# EAGLE design top (EAGLE 9.6.2)
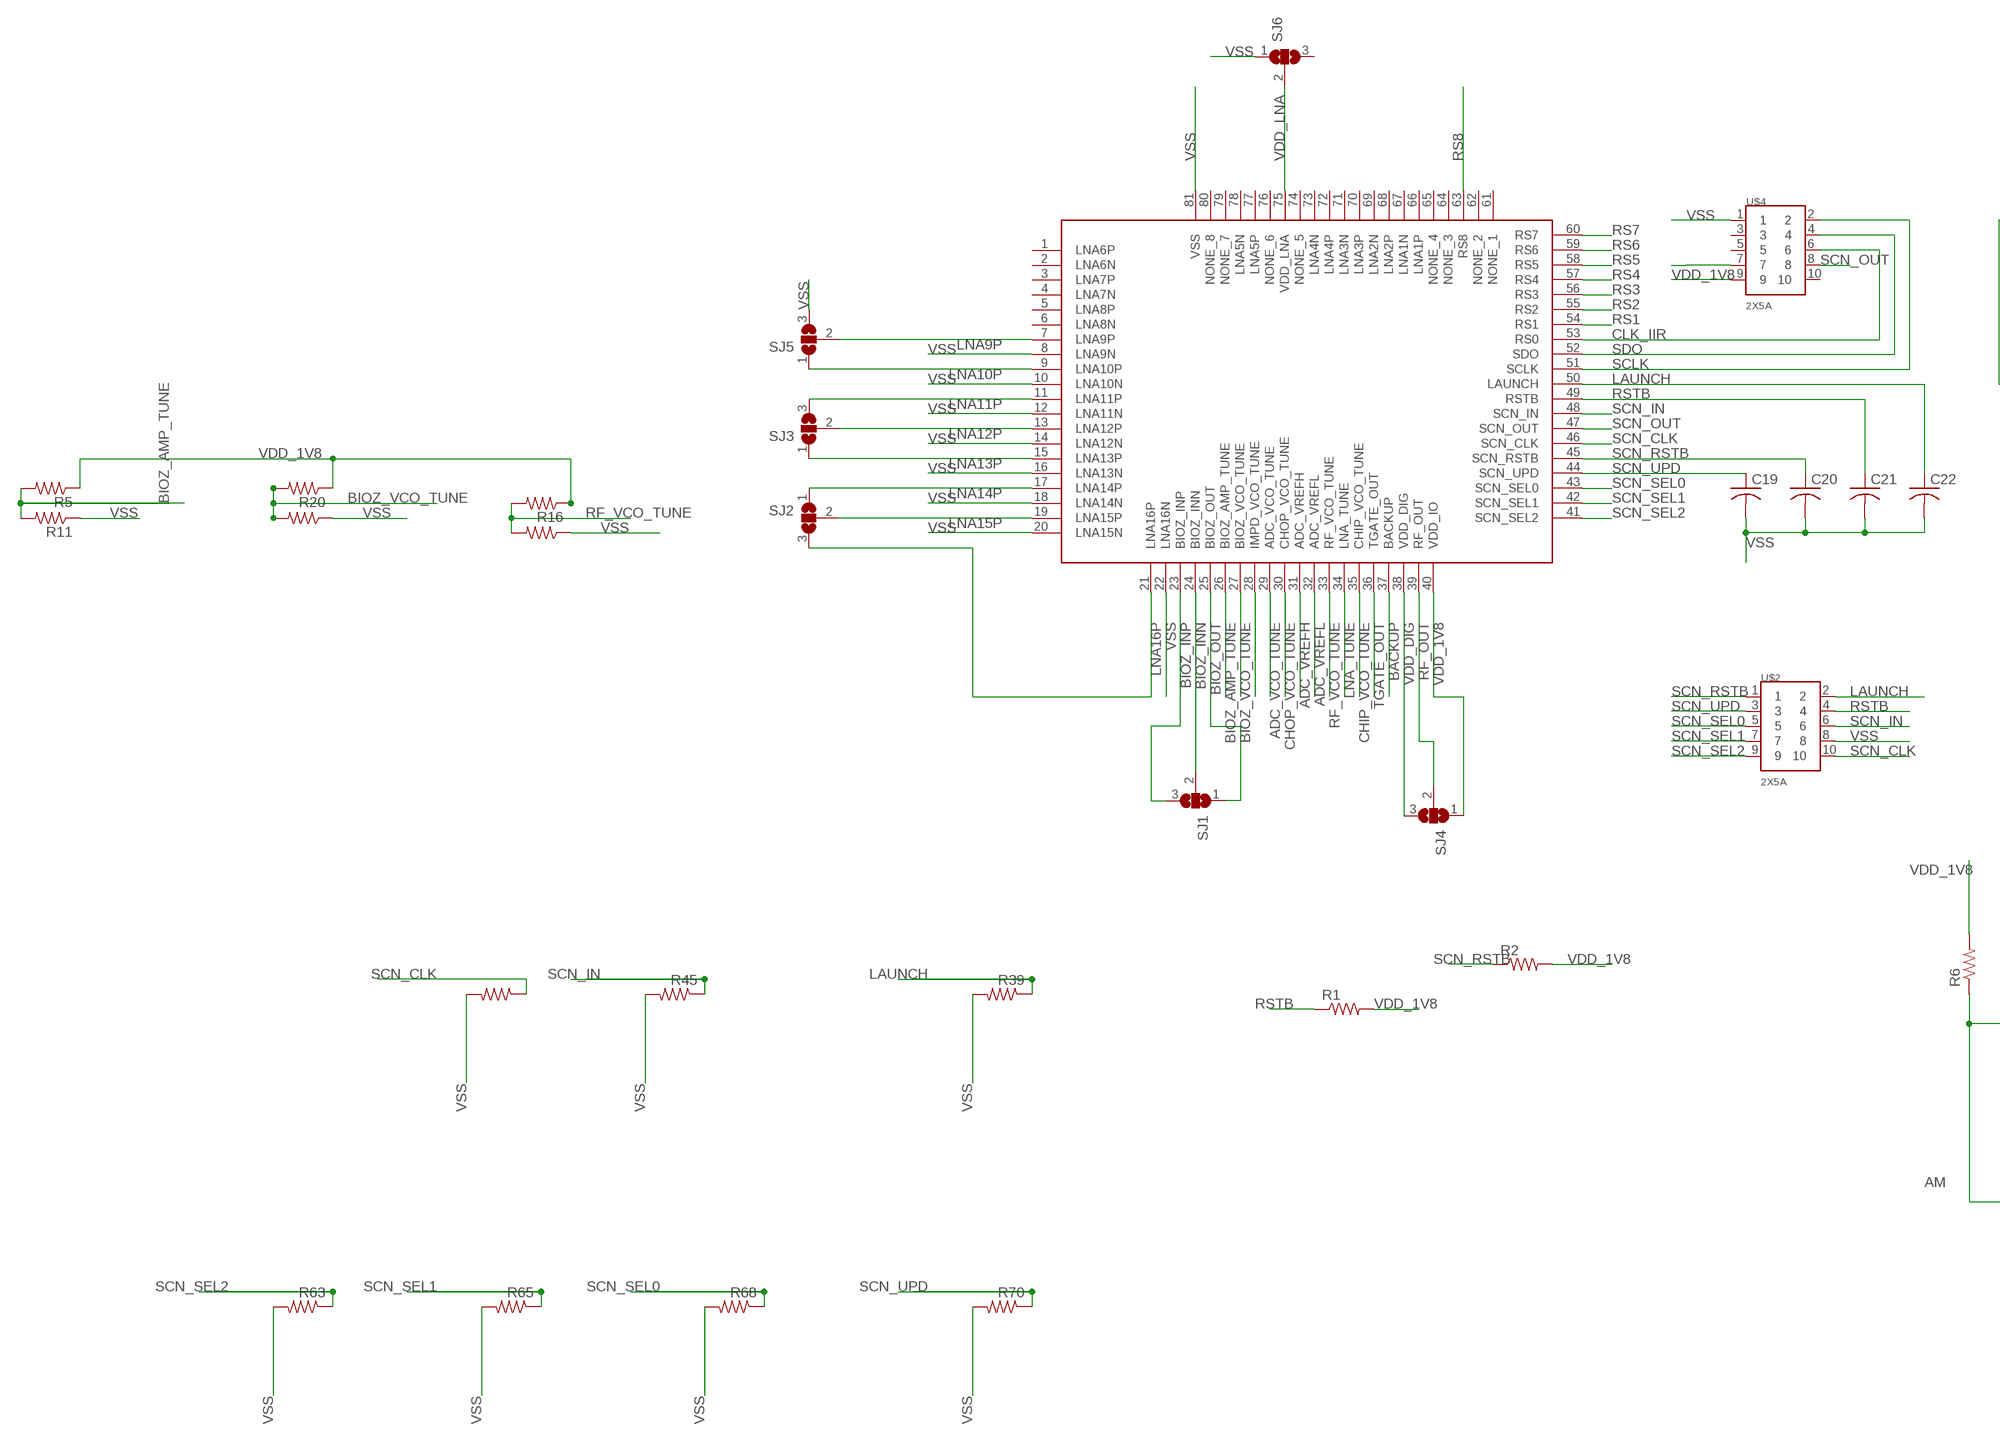
[diagram p0: schematic, sheet 1, part 1 of 2]
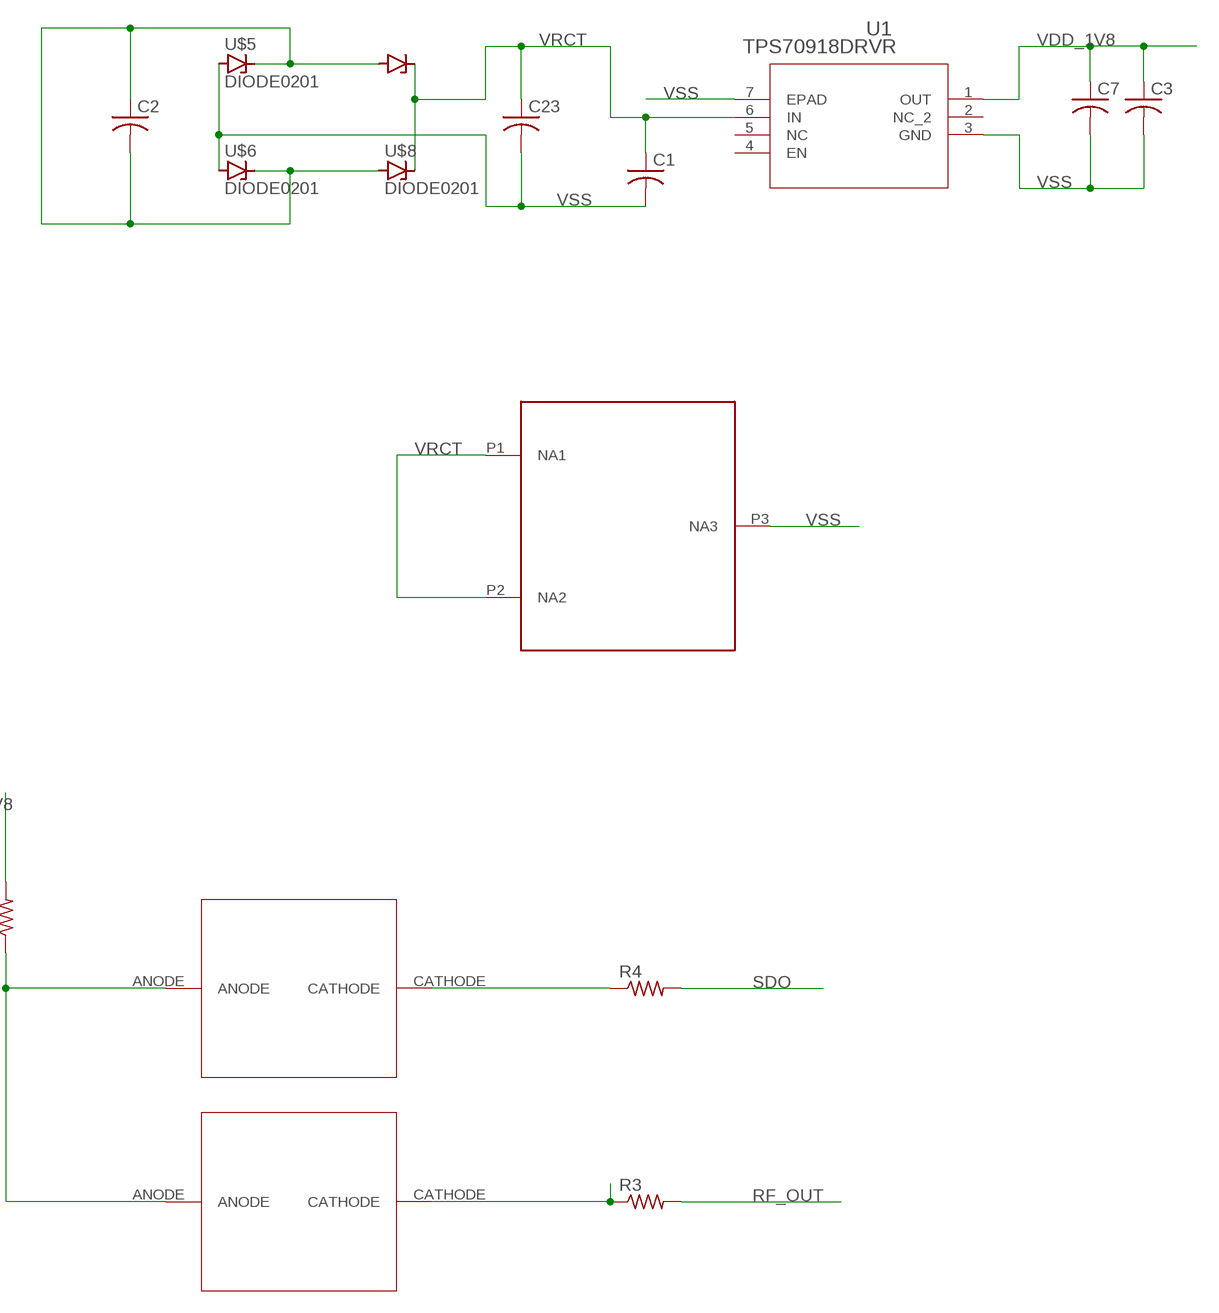
[diagram p1: schematic, sheet 1, part 2 of 2]

## Parts
C1  C-USC0402  [C0402]
C2  C-USC0201  [C0201]
C3  C-USC0402  [C0402]
C7  C-USC1210  [C1210]
C19  C-USC0201  [C0201]
C20  C-USC0201  [C0201]
C21  C-USC0201  [C0201]
C22  C-USC0201  [C0201]
C23  C-USC1210  [C1210]
R1  R-US_R0402  [R0402]
R2  R-US_R0402  [R0402]
R3  R-US_R0402  [R0402]
R4  R-US_R0402  [R0402]
R5  R-US_R0201  [R0201]
R6  R-US_R0402  [R0402]
R11  R-US_R0201  [R0201]
R16  R-US_R0201  [R0201]
R17  R-US_R0201  [R0201]
R20  R-US_R0201  [R0201]
R22  R-US_R0201  [R0201]
R39  R-US_R0402  [R0402]
R45  R-US_R0402  [R0402]
R47  R-US_R0402  [R0402]
R63  R-US_R0402  [R0402]
R65  R-US_R0402  [R0402]
R68  R-US_R0402  [R0402]
R70  R-US_R0402  [R0402]
SJ1  SJ2W  [SJ_2]
SJ2  SJ2W  [SJ_2]
SJ3  SJ2W  [SJ_2]
SJ4  SJ2W  [SJ_2]
SJ5  SJ2W  [SJ_2]
SJ6  SJ2W  [SJ_2]
U1  TPS70918DRVR  [DRV6_1P6X1_TEX]
U$1  CHIP_QFN  [QFN50P1200X1200X80-81T900N]
U$2  2X5A  [2X5-FCI_UNSHROUDED]
U$3  3030TR  [3030TR]
U$4  2X5A  [2X5-FCI_UNSHROUDED]
U$5  DIODE0201  [C0201]
U$6  DIODE0201  [C0201]
U$7  DIODE0201  [C0201]
U$8  DIODE0201  [C0201]
U$9  MSWSE-050-17  [DIODE_MSWSE-050-17]
U$10  MSWSE-050-17  [DIODE_MSWSE-050-17]

## Nets
ADC_VCO_TUNE: U$1.29(ADC_VCO_TUNE)
ADC_VREFH: U$1.31(ADC_VREFH)
ADC_VREFL: U$1.32(ADC_VREFL)
AM: R6.1 U$4.7 U$9.ANODE U$10.ANODE
BACKUP: U$1.37(BACKUP)
BIOZ_AMP_TUNE: R5.2 R11.2 U$1.26(BIOZ_AMP_TUNE)
BIOZ_INN: SJ1.2 U$1.24(BIOZ_INN)
BIOZ_INP: SJ1.3 U$1.23(BIOZ_INP)
BIOZ_OUT: SJ1.1 U$1.25(BIOZ_OUT)
BIOZ_VCO_TUNE: R20.2 R22.2 U$1.27(BIOZ_VCO_TUNE)
CHIP_VCO_TUNE: U$1.35(CHIP_VCO_TUNE)
CHOP_VCO_TUNE: U$1.30(CHOP_VCO_TUNE)
CLK_IIR: U$1.53(RS0) U$4.6
LAUNCH: C22.1 R39.1 U$1.50(LAUNCH) U$2.2
LNA9P: SJ5.2 U$1.7(LNA9P)
LNA10P: SJ5.1 U$1.9(LNA10P)
LNA11P: SJ3.3 U$1.11(LNA11P)
LNA12P: SJ3.2 U$1.13(LNA12P)
LNA13P: SJ3.1 U$1.15(LNA13P)
LNA14P: SJ2.1 U$1.17(LNA14P)
LNA15P: SJ2.2 U$1.19(LNA15P)
LNA16P: SJ2.3 U$1.21(LNA16P)
LNA_TUNE: U$1.34(LNA_TUNE)
N$1: R4.1 U$9.CATHODE
N$2: R3.1 U$10.CATHODE
N$3: U$1.28(IMPD_VCO_TUNE)
N$7: C2.1 C2.2 U$5.2(C) U$6.2(C) U$7.1(A) U$8.1(A)
RF_OUT: R3.2 SJ4.2 U$1.39(RF_OUT)
RF_VCO_TUNE: R16.2 R17.2 U$1.33(RF_VCO_TUNE)
RS1: U$1.54(RS1)
RS2: U$1.55(RS2)
RS3: U$1.56(RS3)
RS4: U$1.57(RS4)
RS5: U$1.58(RS5)
RS6: U$1.59(RS6)
RS7: U$1.60(RS7)
RS8: U$1.63(RS8)
RSTB: C21.1 R1.1 U$1.49(RSTB) U$2.4
SCLK: U$1.51(SCLK) U$4.2
SCN_CLK: R47.1 U$1.46(SCN_CLK) U$2.10
SCN_IN: R45.1 U$1.48(SCN_IN) U$2.6
SCN_OUT: U$1.47(SCN_OUT) U$4.8
SCN_RSTB: C20.1 R2.1 U$1.45(SCN_RSTB) U$2.1
SCN_SEL0: R68.1 U$1.43(SCN_SEL0) U$2.5
SCN_SEL1: R65.1 U$1.42(SCN_SEL1) U$2.7
SCN_SEL2: R63.1 U$1.41(SCN_SEL2) U$2.9
SCN_UPD: C19.1 R70.1 U$1.44(SCN_UPD) U$2.3
SDO: R4.2 U$1.52(SDO) U$4.4
TGATE_OUT: U$1.36(TGATE_OUT)
VDD_1V8: C3.1 C7.1 R1.2 R2.2 R5.1 R6.2 R16.1 R20.1 SJ4.1 U1.1(OUT) U$1.40(VDD_IO) U$4.9
VDD_DIG: SJ4.3 U$1.38(VDD_DIG)
VDD_LNA: SJ6.2 U$1.75(VDD_LNA)
VRCT: C1.1 C23.1 U1.6(IN) U$3.P1(NA1) U$3.P2(NA2) U$7.2(C) U$8.2(C)
VSS: C1.2 C3.2 C7.2 C19.2 C20.2 C21.2 C22.2 C23.2 R11.1 R17.1 R22.1 R39.2 R45.2 R47.2 R63.2 R65.2 R68.2 R70.2 SJ5.3 SJ6.1 U1.3(GND) U1.7(EPAD) U$1.8(LNA9N) U$1.10(LNA10N) U$1.12(LNA11N) U$1.14(LNA12N) U$1.16(LNA13N) U$1.18(LNA14N) U$1.20(LNA15N) U$1.22(LNA16N) U$1.81(VSS) U$2.8 U$3.P3(NA3) U$4.1 U$5.1(A) U$6.1(A)
Unconnected: SJ6.3 U1.2(NC_2) U1.4(EN) U1.5(NC) U$1.1(LNA6P) U$1.2(LNA6N) U$1.3(LNA7P) U$1.4(LNA7N) U$1.5(LNA8P) U$1.6(LNA8N) U$1.61(NONE_1) U$1.62(NONE_2) U$1.64(NONE_3) U$1.65(NONE_4) U$1.66(LNA1P) U$1.67(LNA1N) U$1.68(LNA2P) U$1.69(LNA2N) U$1.70(LNA3P) U$1.71(LNA3N) U$1.72(LNA4P) U$1.73(LNA4N) U$1.74(NONE_5) U$1.76(NONE_6) U$1.77(LNA5P) U$1.78(LNA5N) U$1.79(NONE_7) U$1.80(NONE_8) U$4.3 U$4.5 U$4.10

## Library data of the parts
C1-C3 C7 C19-C23 = rcl:C-US: CAPACITOR, American symbol; SPICEPREFIX: C
R1-R6 R11 R16 R17 R20 R22 R39 R45 R47 R63 R65 R68 R70 = rcl:R-US_: RESISTOR, American symbol; SPICEPREFIX: R
SJ1-SJ6 = jumper:SJ2W: SMD solder JUMPER
U1 = VLSI_qfn56:TPS70918DRVR; COPYRIGHT: Copyright (C) 2023 Ultra Librarian. All rights reserved.; MANUFACTURER_PART_NUMBER: TPS70918DRVR; MFR_NAME: Texas Instruments
U$1 = Charlie:CHIP_QFN
U$2 U$4 = Ilya_Teach:2X5
U$3 = VLSI_qfn56:3030TR
U$5-U$8 = VLSI_qfn56:DIODE0201
U$9 U$10 = MSWSE-050-17_PAD:MSWSE-050-17

## Board
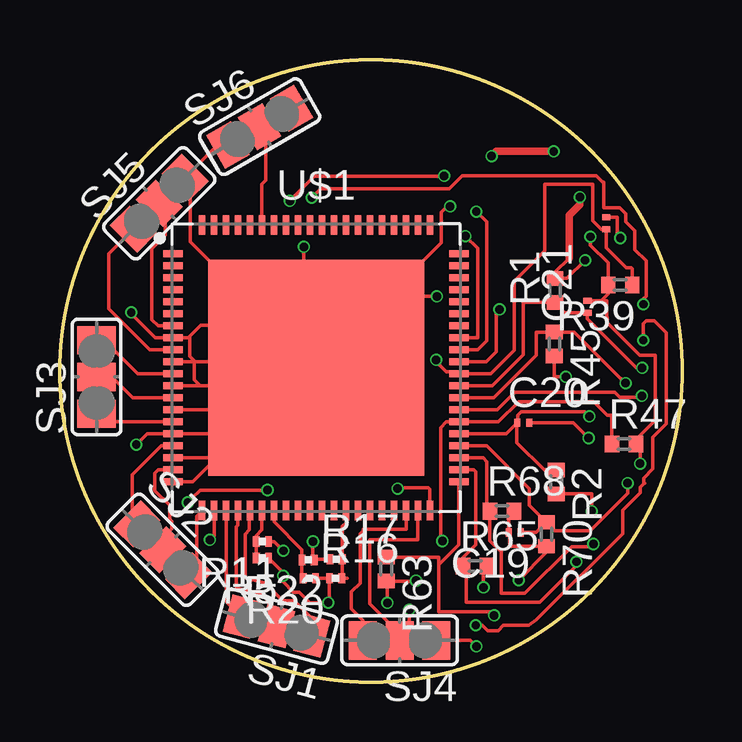
[diagram p2: board, top side]
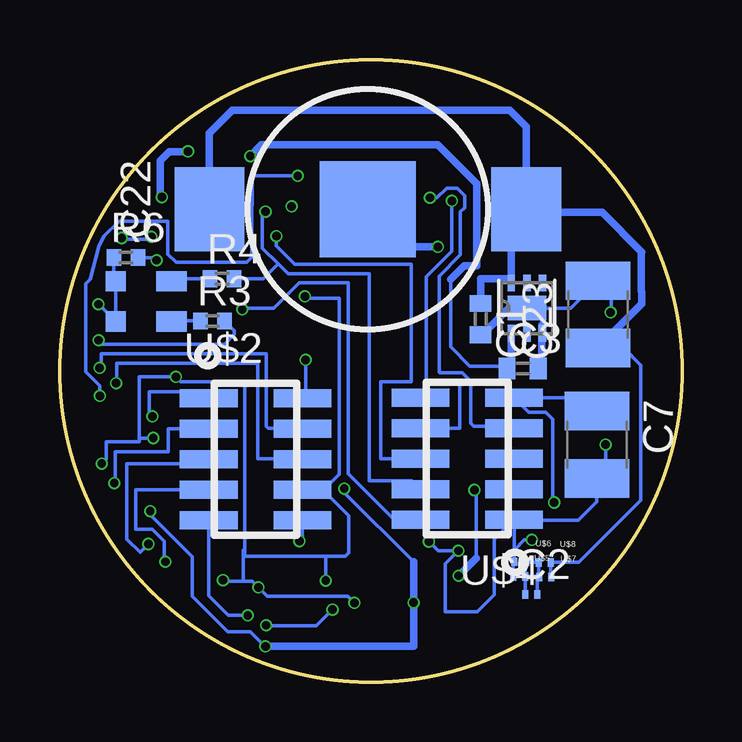
[diagram p3: board, bottom side, seen from below]

Size 25.91 x 25.91 mm. Coordinates in mm from the lower left corner, seen from the top.
Outline: circle at 12.95,12.95 radius 12.95
Copper layers (1*16): Top 0.035mm / dielectric 1.6mm / Bottom 0.035mm
Design rules "jlcpcb-2layers *": minimum track width 5mil, minimum drill 0.3mm, track to track 8mil, track to pad 8mil, pad to pad 7.5mil, via to via 8mil, smd to smd 8mil, copper to edge 0.3mm, drill to drill 0.5mm, minimum pad ring 10mil, minimum via ring 3mil, stop-mask expansion 4mil, vias tented up to drill 0mil, thermal gap 10mil

### Footprints (pad centres in the part's own frame; a part is rotated, then mirrored left to right if it is on the bottom)
C0402 = smd 0.7 x 0.9: 1 -0.65,0; 2 0.65,0
C0201 = smd 0.25 x 0.35: 1 -0.25,0; 2 0.25,0
C1210 = smd 1.6 x 2.7: 1 -1.4,0; 2 1.4,0
R0402 = smd 0.6 x 0.7: 1 -0.5,0; 2 0.5,0
R0201 = smd 0.28 x 0.43: 1 -0.255,0; 2 0.255,0
SJ_2 = smd 1.168 x 1.6: 1 -1.524,0; 2 0,0; 3 1.524,0
DRV6_1P6X1_TEX = smd 0.7 x 0.3: 1 -1.05,0.65; 2 -1.05,0; 3 -1.05,-0.65; 4 1.05,-0.65; 5 1.05,0; 6 1.05,0.65 | smd 1.016 x 1.6: 7 0,0
QFN50P1200X1200X80-81T900N = smd 0.812 x 0.282: 1 -5.95,4.75; 2 -5.95,4.25; 3 -5.95,3.75; 4 -5.95,3.25; 5 -5.95,2.75; 6 -5.95,2.25; 7 -5.95,1.75; 8 -5.95,1.25; 9 -5.95,0.75; 10 -5.95,0.25; 11 -5.95,-0.25; 12 -5.95,-0.75; 13 -5.95,-1.25; 14 -5.95,-1.75; 15 -5.95,-2.25; 16 -5.95,-2.75; 17 -5.95,-3.25; 18 -5.95,-3.75; 19 -5.95,-4.25; 20 -5.95,-4.75; 41 5.95,-4.75; 42 5.95,-4.25; 43 5.95,-3.75; 44 5.95,-3.25; 45 5.95,-2.75; 46 5.95,-2.25; 47 5.95,-1.75; 48 5.95,-1.25; 49 5.95,-0.75; 50 5.95,-0.25; 51 5.95,0.25; 52 5.95,0.75; 53 5.95,1.25; 54 5.95,1.75; 55 5.95,2.25; 56 5.95,2.75; 57 5.95,3.25; 58 5.95,3.75; 59 5.95,4.25; 60 5.95,4.75 | smd 0.282 x 0.812: 21 -4.75,-5.95; 22 -4.25,-5.95; 23 -3.75,-5.95; 24 -3.25,-5.95; 25 -2.75,-5.95; 26 -2.25,-5.95; 27 -1.75,-5.95; 28 -1.25,-5.95; 29 -0.75,-5.95; 30 -0.25,-5.95; 31 0.25,-5.95; 32 0.75,-5.95; 33 1.25,-5.95; 34 1.75,-5.95; 35 2.25,-5.95; 36 2.75,-5.95; 37 3.25,-5.95; 38 3.75,-5.95; 39 4.25,-5.95; 40 4.75,-5.95; 61 4.75,5.95; 62 4.25,5.95; 63 3.75,5.95; 64 3.25,5.95; 65 2.75,5.95; 66 2.25,5.95; 67 1.75,5.95; 68 1.25,5.95; 69 0.75,5.95; 70 0.25,5.95; 71 -0.25,5.95; 72 -0.75,5.95; 73 -1.25,5.95; 74 -1.75,5.95; 75 -2.25,5.95; 76 -2.75,5.95; 77 -3.25,5.95; 78 -3.75,5.95; 79 -4.25,5.95; 80 -4.75,5.95 | smd 9 x 9: 81 0,0
2X5-FCI_UNSHROUDED = smd 0.76 x 2.4: 1 -2.54,-1.95; 2 -2.54,1.95; 3 -1.27,-1.95; 4 -1.27,1.95; 5 0,-1.95; 6 0,1.95; 7 1.27,-1.95; 8 1.27,1.95; 9 2.54,-1.95; 10 2.54,1.95
3030TR = smd 2.9 x 3.5: P1 -6.6,0; P2 6.6,0 | smd 4 x 4: P3 0,0
DIODE_MSWSE-050-17 = smd 0.838 x 0.838: ANODE 0,1.054 | smd 0.838 x 1.27: CATHODE 0,-1.27

### Placement (x,y rotation side)
C1  8.38,15.11 270 bottom
C2  6.27,3.63 0 bottom
C3  6.63,13.06 0 bottom
C7  3.53,9.88 270 bottom
C19  18.95,6.22 180 top
C20  19.3,10.79 0 top
C21  21.97,15.62 90 top
C22  22.76,19.1 90 top
C23  3.49,15.31 90 bottom
R1  20.62,16.31 90 top
R2  20.68,8.33 270 top
R3  19.56,15.04 0 bottom
R4  19.15,16.79 0 bottom
R5  8.43,5.16 180 top
R6  23.16,17.68 0 bottom
R11  8.43,5.84 180 top
R16  11.48,4.32 0 top
R17  11.51,5.11 0 top
R20  10.39,4.32 180 top
R22  10.34,5.08 180 top
R39  23.34,16.54 180 top
R45  20.6,14.07 270 top
R47  23.5,9.91 0 top
R63  13.59,4.7 270 top
R65  17.3,4.83 0 top
R68  18.41,7.11 0 top
R70  20.27,6.15 270 top
SJ1  9.02,2.32 165 top
SJ2  4.28,5.5 315 top
SJ3  1.52,12.7 90 top
SJ4  14.15,1.73 180 top
SJ5  4.14,19.94 45 top
SJ6  8.32,23.13 30 top
U1  6.45,15.57 90 bottom
U$1  10.67,13.08 0 top
U$2  17.76,9.27 270 bottom
U$3  13.08,19.68 0 bottom
U$4  8.94,9.3 90 bottom
U$5  6.78,4.39 0 bottom
U$6  6.73,5 0 bottom
U$7  5.69,4.37 0 bottom
U$8  5.71,4.98 0 bottom
U$9  22.53,16.69 90 bottom
U$10  22.53,15.01 90 bottom

### Tracks (layer width: path | path; a pad name or v marks a point on that pad's centre or on a via)
AM  (via drill 0.35)
  Top 0.152: v24.31,15.73 24.31,15.96 24.42,16.07 24.42,17.54 23.95,18.01 23.95,18.79 23.57,19.16 23.57,19.5 23.31,19.75 22.66,19.75 22.66,20.81 22.62,20.81 22.35,21.08 16.75,21.08 16.22,20.55 10.87,20.55 v10.49,20.17
  Bottom 0.152: 23.58,14.99 U$10.ANODE | U$10.ANODE U$9.ANODE 23.66,16.77 R6.1 | v10.49,20.17 10.2,20.17 9.8,20.57 9.36,20.57 9.05,20.26 9.05,19.75 9.22,19.58 9.22,17.78 10.11,16.9 10.11,12.9 10.08,12.88 9.15,12.88 8.8,12.52 8.8,10.78 8.66,10.64 7.07,10.64 U$4.7 | U$10.ANODE v24.3,15.73 v24.31,15.73
BIOZ_AMP_TUNE
  Top 0.152: R5.2 R11.2 8.18,6.09 8.41,6.33 U$1.26
BIOZ_INN
  Top 0.152: SJ1.2 9.02,2.92 8.78,3.15 8.53,3.6 7.41,3.9 7.35,3.95 7.35,6.47 7.42,6.53 7.42,6.76 | 7.42,6.76 U$1.24 7.42,6.76
BIOZ_INP
  Top 0.152: U$1.23 6.92,3.34 SJ1.3
BIOZ_OUT
  Top 0.152: SJ1.1 10.6,2.03 10.6,2.53 9.75,3.38 9.29,3.38 8.56,4.1 7.71,4.33 7.71,6.14 7.89,6.33 7.89,7.11 U$1.25
BIOZ_VCO_TUNE
  Top 0.152: R20.2 10.08,4.37 R22.2 10.08,5.5 8.92,6.66 U$1.27
CLK_IIR  (via drill 0.35)
  Top 0.152: U$1.53 17.4,14.34 17.4,18.07 v16.89,18.57
  Bottom 0.152: U$4.6 12.39,9.3 12.55,9.3 12.55,12.5 11.28,12.5 11.28,17.41 12.55,17.41 12.55,17.4 16.13,17.4 16.89,18.16 v16.89,18.57
LAUNCH  (via drill 0.35)
  Top 0.152: R39.1 23.84,17.21 23.8,17.25 23.59,17.25 22.76,18.09 C22.1 22.55,18.85 22.2,19.21 22.2,20.73 20.19,20.73 20.19,17.96 18.92,16.69 18.92,13.81 17.95,12.84 U$1.50 16.54,12.91 16.1,12.91 15.67,13.34 v15.67,13.41
  Bottom 0.152: 16.06,12.06 U$2.2 15.67,11.95 v15.67,13.41
LNA9P
  Top 0.152: U$1.7 4.09,14.84 3.83,15.1 3.83,18.05 4.39,18.61 4.39,19.94 SJ5.2
LNA10P
  Top 0.152: U$1.9 3.75,13.83 2.03,15.54 2.03,17.83 SJ5.1
LNA11P
  Top 0.152: SJ3.3 1.84,14.22 3.24,12.83 U$1.11
LNA12P
  Top 0.152: SJ3.2 2.16,12.7 3.03,11.83 U$1.13
LNA13P
  Top 0.152: U$1.15 1.86,10.84 SJ3.1
LNA14P
  Top 0.152: U$1.17 4.22,9.83 3.02,8.63 3.02,6.76 SJ2.1
LNA15P
  Top 0.152: U$1.19 4.09,8.83 3.96,8.69 3.96,7.97 4.57,7.35 4.57,6.79 4.67,6.7 4.67,6.38 4.15,5.87 4.15,5.62 SJ2.2
LNA16P
  Top 0.152: SJ2.3 5.69,4.42 5.69,6.9 U$1.21
N$1
  Bottom 0.152: R4.1 21.16,16.79 U$9.CATHODE
N$2
  Bottom 0.152: R3.1 21.23,15.04 U$10.CATHODE
N$7
  Bottom 0.152: U$5.2 6.53,4.95 U$6.2 6.46,4.98 U$8.1 5.96,4.39 | U$5.2 5.96,4.39 | 5.96,4.39 U$7.1 6.02,4.29 C2.2 | U$5.2 C2.1
RF_OUT  (via drill 0.35)
  Top 0.152: U$1.39 14.91,5.92 12.91,5.92 12.91,3.25 14.15,2.01 SJ4.2 14.55,2.13 v14.55,3.01 14.54,3 | v17.32,2.36 17.59,2.36 17.81,2.14 18.25,2.14 18.47,2.36 19.53,2.36 19.85,2.58 23.44,6.17 23.44,7.14 24.18,7.88 24.18,8.1 24.32,8.24 | 24.32,8.24 24.36,8.28 | 24.32,8.24 24.32,8.49 24.7,8.87 24.7,10.19 25.25,10.74 25.25,14.55 24.77,15.03 24.42,15.03 24.3,14.91 v24.3,14.23
  Bottom 0.152: v14.55,3.01 15.23,2.33 17.3,2.33 v17.32,2.36 | v24.3,14.23 24.14,14.07 19.05,14.07 18.64,14.48 18.64,14.62 R3.2
RF_VCO_TUNE
  Top 0.152: U$1.33 11.92,6.63 11.76,6.47 R17.2 11.76,4.34 R16.2 11.96,4.32
RSTB  (via drill 0.35)
  Top 0.152: U$1.49 18,12.33 19.3,13.63 19.3,15.81 R1.1 20.62,15.77 21.03,15.37 C21.1 21.97,15.12 24.01,13.08 v24.25,13.08
  Bottom 0.152: v24.25,13.08 24.18,13.08 24.18,13.66 17.31,13.66 17.31,10.65 17.23,10.57 15.84,10.57 U$2.4
SCLK  (via drill 0.35)
  Top 0.152: U$1.51 17.76,13.33 18.18,13.75 18.18,15.39 v18.31,15.52
  Bottom 0.152: U$4.2 11.99,6.76 13.89,8.66 13.89,16.62 15.95,16.62 16.99,15.57 18.26,15.57 v18.31,15.52
SCN_CLK  (via drill 0.35)
  Top 0.152: R47.1 23,11.1 22.8,11.1 22.23,11.67 19.11,11.67 18.27,10.83 U$1.46 16.1,10.83 15.86,10.59 15.86,5.94 v15.94,5.87
  Bottom 0.152: 15.84,6.76 U$2.10 | U$2.10 16.76,6.73 | U$2.10 15.81,5.99 v15.94,5.87
SCN_IN  (via drill 0.35)
  Top 0.152: U$1.48 18.07,11.84 19.84,13.61 19.84,14.57 R45.1 21.42,14.57 23.36,12.63 23.39,12.63 v23.57,12.45
  Bottom 0.152: v23.57,12.45 23.55,12.47 23.55,13.27 17.67,13.27 17.67,9.3 15.84,9.3 U$2.6
SCN_OUT  (via drill 0.35)
  Top 0.152: U$1.47 18.21,11.33 18.95,12.07 23.12,12.07 23.33,11.87 24.06,11.87 24.18,11.98 v24.25,11.91 | v16,21.08 15.98,21.06 10.6,21.06 v9.58,20.04
  Bottom 0.152: U$4.8 9.26,10.57 9.26,12.48 9.3,12.52 10.64,12.52 10.64,16.87 9.58,17.93 v9.58,20.04 | 24.25,11.94 v24.25,11.91 24.25,12.32 24.84,12.91 24.84,16.58 24.65,16.77 24.28,18.13 24.08,18.56 23.44,19.2 21.41,19.2 21.41,17.82 21.07,17.48 18.14,17.48 17.93,17.69 17.93,19.83 17.91,19.85 17.91,21.08 v16,21.08
SCN_RSTB  (via drill 0.35)
  Top 0.152: U$1.45 18.59,10.33 C20.1 | C20.1 19.04,10.79 19.04,9.97 20.18,8.83 R2.1 | v22.06,11.06 21.86,11.25 19.21,11.25 19.07,11.11 19.07,10.81 C20.1
  Bottom 0.152: v22.06,11.06 22.18,11.19 22.18,12.09 19.99,12.09 U$2.1
SCN_SEL0  (via drill 0.35)
  Top 0.152: U$1.43 17.63,9.33 17.79,9.18 17.79,7.24 R68.1 17.91,5.88 18.38,5.41 18.38,3.68 19.37,3.68 21.32,5.64 22.12,5.64 v22.23,5.74
  Bottom 0.152: v22.23,5.74 22.57,5.4 23.12,5.95 23.12,9.09 19.89,9.09 U$2.5
SCN_SEL1  (via drill 0.35)
  Top 0.152: U$1.42 17.25,8.83 17.32,8.75 17.32,5.71 16.8,5.18 R65.1 | 16.55,5.07 R65.1 | v21.51,5 21.51,4.83 20,3.31 16.94,3.31 16.94,4.69 R65.1
  Bottom 0.152: v21.51,5 21.57,5.06 21.57,5.85 22.06,6.35 22.76,6.35 22.76,8 U$2.7
SCN_SEL2  (via drill 0.35)
  Top 0.152: U$1.41 16.62,5.71 15.77,4.87 | v18.09,2.77 17.93,2.92 15.77,2.92 15.77,4.87 | R63.1 15.77,5.2 15.77,4.87
  Bottom 0.152: v18.09,2.77 18.9,2.77 19.71,3.58 U$2.9
SCN_UPD  (via drill 0.35)
  Top 0.152: U$1.44 17.78,9.83 19.56,8.05 19.56,7.36 R70.1 | R70.1 20.4,6.52 | C19.1 19.84,6.22 R70.1 | R70.1 20.62,6.29 22.09,6.29 23.65,7.85 v23.65,8.28
  Bottom 0.152: v23.65,8.28 23.6,8.28 23.6,9.59 21.4,9.59 21.4,10.54 U$2.3
SDO  (via drill 0.35)
  Top 0.152: U$1.52 17.4,13.84 17.78,14.21 17.78,19.16 v17.34,19.59
  Bottom 0.152: v17.34,19.59 17.47,19.46 17.47,18.07 16.81,17.41 | 16.81,17.41 16.4,17 13.03,17 13.03,8.38 11.25,8.38 U$4.4 | 16.81,17.41 17.43,16.79 R4.2
VDD_1V8  (via drill 0.35)
  Top 0.152: 8.69,5.11 R5.1 9.3,4.55 v9.3,4.42 9.3,4.16 9.72,3.73 9.97,3.73 10.41,3.3 v11.18,3.3 11.23,3.35 R16.1 R20.1 | U$1.40 15.41,8.01 15.35,8.08 13.98,8.08 | v17.35,1.47 17.09,1.73 SJ4.1 | 21.21,17.65 20.62,17.07 R1.2 21.12,16.81 v21.88,17.57 | R2.2 22.15,7.83 v22.15,7.11 | v5.32,7.47 5.5,7.65 5.84,7.99 v8.64,7.99
  Top 0.305: v17.98,21.9 18.18,22.1 v20.57,22.1 | v21.66,20.19 21.66,19.88 21.21,19.43 21.21,17.65 | 13.98,8.08 v14.07,8.05
  Bottom 0.152: v22.15,7.11 22.15,6.96 20.39,5.2 20.39,3.57 18.91,2.09 17.99,2.09 17.36,1.46 v17.35,1.47 | v21.66,20.19 21.74,20.11 21.74,20.22 21.74,21.66 21.73,21.66 | v14.07,8.05 14.07,7.89 11.18,5 | v21.88,17.57 22,17.68 R6.2 | C7.1 4.37,11.28 | 8.56,5.16 8.56,8 8.63,8 v8.64,7.99 | C3.1 7.38,13.16 8.83,13.16 9.63,13.95 9.63,16.77 | 7.02,13.06 C3.1 | C7.1 3.56,11.28 | C7.1 3.54,10.99 | C3.1 7.28,12.73 | C7.1 4.1,11.84 6.93,11.84 | 6.93,11.84 U$4.9 6.38,11.23 5.67,11.23 5.38,10.94 5.38,7.53 v5.32,7.47 | C3.1 7.28,12.18 6.93,11.84
  Bottom 0.305: U1.1 7.1,14.28 | 8.56,5.16 v9.3,4.42 | U1.1 7.1,14.14 | v17.98,21.9 17.51,22.37 10.17,22.37 8.54,20.74 8.54,17.34 9.06,17.34 9.63,16.77 | v20.57,22.1 20.65,22.1 20.65,22.09 21.35,22.09 21.74,21.7 21.74,20.22 | 11.18,5 v11.18,3.3 11.18,1.47 v17.35,1.47 | C3.1 7.1,13.23 U1.1
VDD_DIG
  Top 0.152: 12.43,1.92 SJ4.3 12.62,2.57 12.14,3.05 12.14,3.74 12.5,4.1 12.5,6.16 12.64,6.29 12.64,6.35 14.42,6.35 U$1.38
VDD_LNA
  Top 0.152: SJ6.2 8.57,22.88 8.57,20.89 8.41,20.73 U$1.75
VRCT
  Bottom 0.152: 1.66,17.91 1.66,17.86 | 1.66,17.86 1.66,16.26 | 1.66,17.86 1.68,17.88 3.36,19.56 6.22,19.56 | 18.67,23.88 18.73,23.81 | U$7.2 5.46,4.39 U$8.2 4.3,4.98 1.7,7.57 1.7,13.19 2.43,13.91 C23.1 | U$3.P2 6.48,19.56
  Bottom 0.305: U$3.P1 19.68,22.86 18.73,23.81 7.18,23.81 6.48,23.12 U$3.P2 7.1,19.06 U1.6 7.1,16.79 8.38,16.79 C1.1 | C23.1 1.66,15.74 1.66,16.26 1.68,16.28 1.68,17.88 | 1.66,17.91 3.31,19.56 6.22,19.56 6.48,19.56
VSS  (via drill 0.35)
  Top 0.152: U$1.12 5.84,12.33 | 5.84,12.33 9.53,12.33 | 9.53,12.33 9.92,12.33 | 9.92,12.33 U$1.81 | U$1.14 8.92,11.33 | 8.92,11.33 9.92,12.33 | 7.92,10.33 U$1.16 3.62,10.33 v3.17,9.88 | 7.92,10.33 8.92,11.33 | U$1.18 6.92,9.33 | 6.92,9.33 7.92,10.33 | U$1.20 5.53,8.33 9.53,12.33 | 10.54,13.2 10.41,13.2 | 5.64,13.33 10.54,13.33 13.27,16.06 v15.71,16.06 | 5.64,13.33 5.59,13.33 | 5.59,13.33 U$1.10 | 10.54,13.2 5.42,18.33 5.42,20.95 5.34,21.03 SJ5.3 6.57,22.37 SJ6.1 | 6.42,8.83 6.92,9.33 | R11.1 8.93,5.84 v9.31,5.46 | U$1.8 | U$1.8 5.35,14.34 5.4,14.39 | 5.4,14.39 5.87,14.86 9.78,14.86 6.42,11.5 | v21.08,12.71 20.6,12.71 R45.2 | v17.64,3.94 17.64,4.67 R65.2 | v22.02,10.16 21.39,10.79 C20.2 19.51,10.75 | 21.97,18.41 v22.1,18.54 22.1,18.19 22.84,17.45 R39.2 22.84,16.16 22.55,15.88 | v23.34,18.49 23.22,18.62 23.22,19.35 C22.2 | R47.2 24.06,9.97 | v24.17,9.09 24.17,9.73 R47.2 | C21.2 22.55,15.88 | 22.55,15.88 22.78,15.88 22.78,15.16 22.8,15.19 22.8,14.96 24.15,13.61 24.81,13.61 24.81,10.9 24,10.09 R47.2 | R68.2 18.7,6.89 C19.2 18.74,6.18 18.74,5.65 R70.2 20.27,5.39 v19.11,4.24 | v13.64,3.29 13.64,4.15 R63.2 14.82,4.2 v14.83,4.22 | v10.16,18.12 10.16,13.59 U$1.81 | v2.97,15.39 2.97,15.33 3.96,14.34 U$1.8 | v16.26,19.81 16.13,19.81 15.88,19.56 15.88,18.29 U$1.81 | R17.1 10.54,5.11 | R22.1 10.54,5.08 10.54,5.11 | v10.54,5.85 10.54,5.11 | 5.4,14.39 5.4,14.09 5.4,13.57 5.64,13.33 | U$1.22 6.42,6.09 v6.25,5.91 | U$1.81 10.54,13.2 | 5.84,12.33 5.59,12.59 5.59,13.33
  Bottom 0.152: U1.7 6.38,15.65 5.83,15.1 5.83,14.86 5.8,14.83 U1.3 | C23.2 3.75,16.96 4.58,16.96 | U$4.1 6.63,6.76 6.6,6.73 4.31,6.73 3.54,7.51 C7.2 3.17,8.84 v3.17,9.88 | v24.17,9.09 23.99,9.27 23.99,10.01 22.61,10.01 22.61,10.11 | 22.61,10.11 22.61,12.71 v21.08,12.71 20.87,12.5 18.39,12.5 18.2,12.31 18.2,5.23 14.83,5.23 | v15.71,16.06 15.71,15.98 | 15.71,15.98 | 15.71,15.98 14.28,15.98 14.28,8.64 14.92,8 U$2.8 15.78,8.03 14.99,8.03 13.95,6.99 | 13.21,19.81 U$3.P3 11.52,18.12 | U$5.1 7.03,4.95 U$6.1 6.99,5.49 | U$4.1 6.99,5.49 | U$4.1 7.81,5.94 7.81,3.63 8.52,2.92 9.85,2.92 9.85,4.92 v9.31,5.46 10.16,5.46 v10.54,5.85 | 13.95,6.98 13.95,6.99 | 18.28,4.19 18.28,5.49 18.25,5.49 | 18.95,4.19 18.94,4.19 | 18.94,4.19 18.28,4.19 | 18.28,4.19 17.9,4.19 v17.64,3.94 17.27,3.57 13.92,3.57 v13.64,3.29 | v19.11,4.24 18.99,4.24 18.94,4.19 | C23.2 2.94,16.16 2.94,15.54 2.97,15.52 v2.97,15.39 | C23.2 2.92,16.14 | v23.34,18.49 23.29,18.44 22.2,18.44 v22.1,18.54 | C23.2 4.63,15.57 U1.7 | U1.7 6.21,15.81 | 13.95,6.99 13.87,6.91 13.87,5.39 14.02,5.23 14.83,5.23 | v14.83,4.22 14.83,5.23 | v22.02,10.16 22.56,10.16 22.61,10.11 | v6.25,5.91 6.57,5.91 6.99,5.49
  Bottom 0.305: v10.16,18.12 11.52,18.12 13.21,19.81 | C1.2 8.31,14.46 6.96,15.81 6.21,15.81 | C3.2 5.83,13.21 5.83,14.86